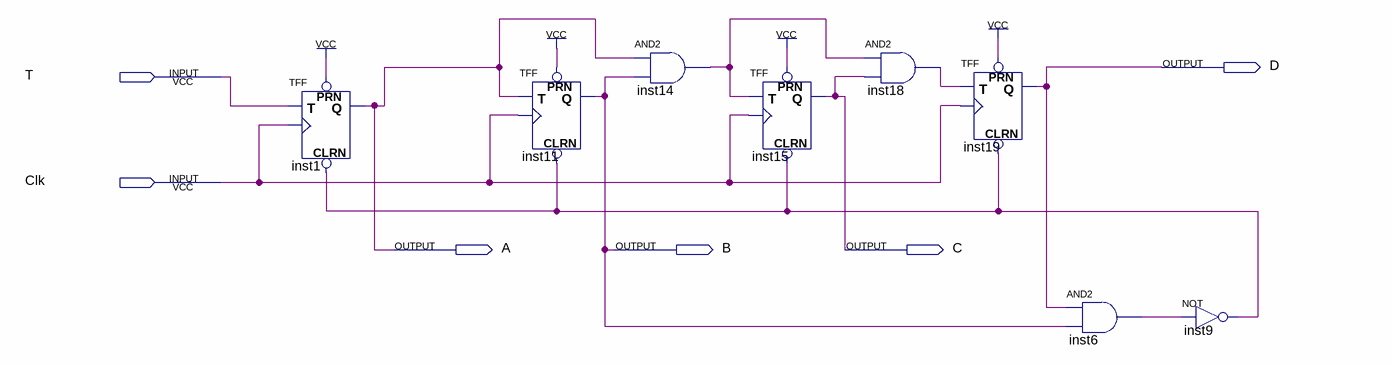
[diagram p0: schematic sheet]
// Quartus schematic Contador.bdf as structural Verilog: 8 symbols, 6 pins
module Contador (
  input  T,
  input  Clk,
  output D,
  output A,
  output B,
  output C
);

  wire inst6_out, inst9_out, inst14_out, inst18_out;

  TFF inst1 (.PRN(1'b1), .CLRN(inst9_out), .T(T), .CLK(Clk), .Q(A));
  TFF inst11 (.PRN(1'b1), .CLRN(inst9_out), .T(A), .CLK(Clk), .Q(B));
  and inst14 (inst14_out, A, B);
  TFF inst15 (.PRN(1'b1), .CLRN(inst9_out), .T(inst14_out), .CLK(Clk), .Q(C));
  and inst18 (inst18_out, inst14_out, C);
  TFF inst19 (.PRN(1'b1), .CLRN(inst9_out), .T(inst18_out), .CLK(Clk), .Q(D));
  and inst6 (inst6_out, D, B);
  not inst9 (inst9_out, inst6_out);
endmodule
